# Altium schematic sheet bozza.SchDoc
size A3; Organization: Altium Limited; Address1: L3, 12a Rodborough Rd; Address2: Frenchs Forest; Address3: NSW; Address4: Australia 2086
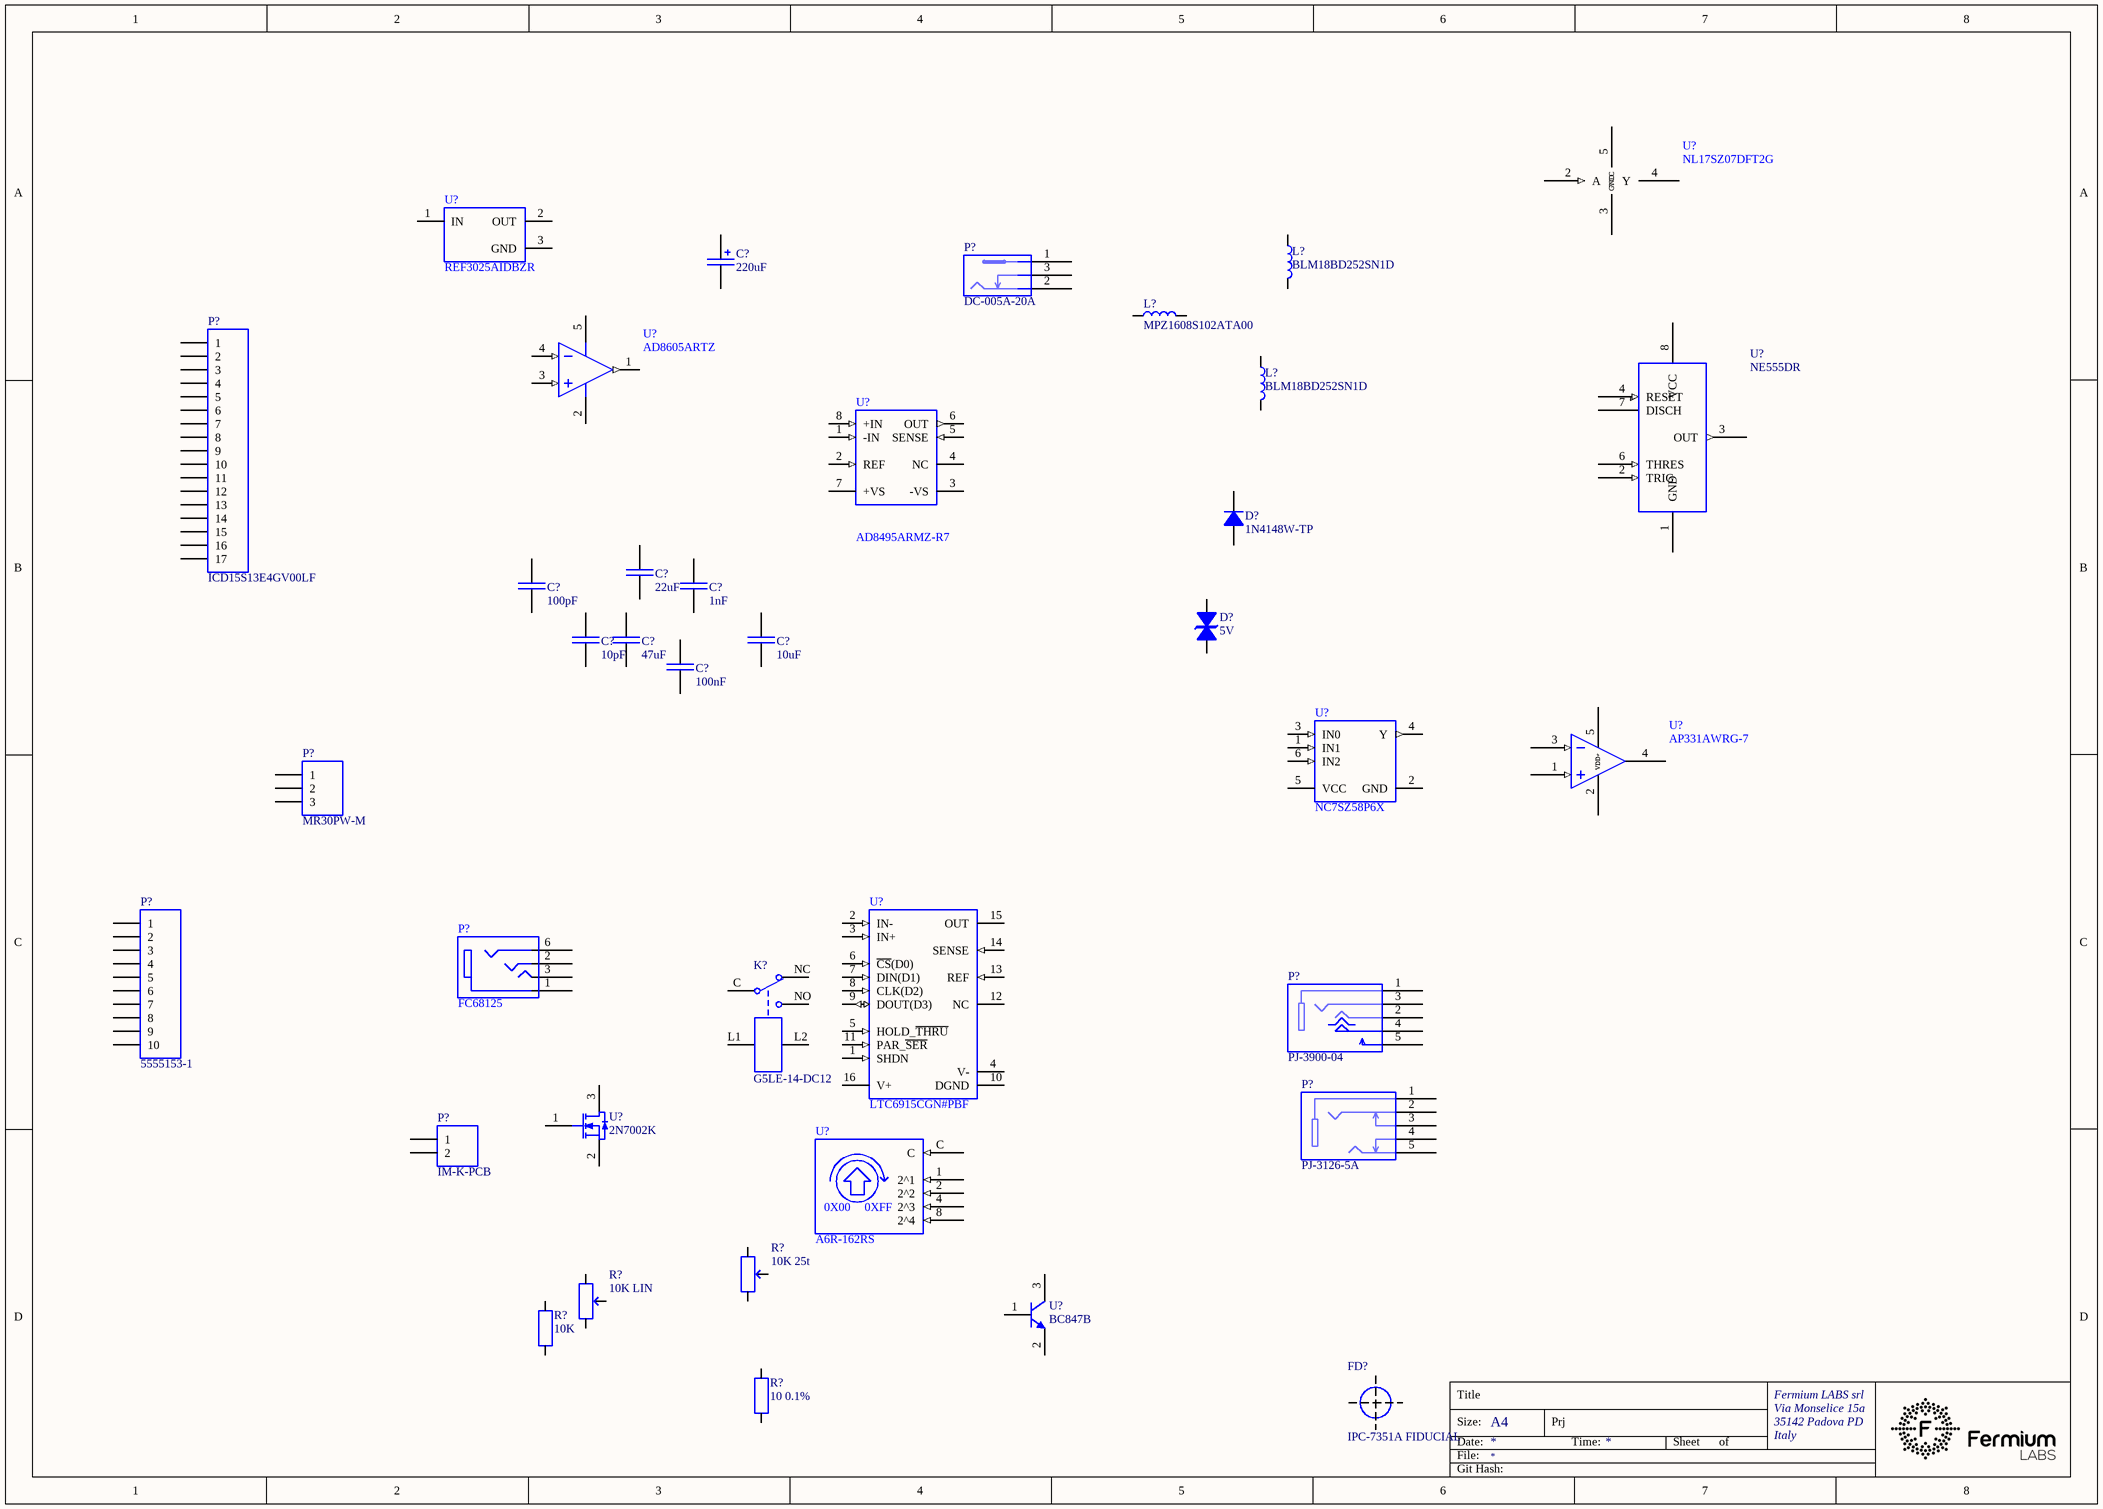
[diagram p0: bozza.SchDoc]

## Parts
(Parts that share a designator on the sheet are numbered #1, #2 ... from top to bottom, then left to right.)
C?#1  220uF  [3924B366-8672-45E9-B0BE-62DACC24E783]
C?#2  22uF  [CAP 0805_2012]
C?#3  100pF  [CAP 0603_1608]
C?#4  1nF  [CAP 0603_1608]
C?#5  10pF  [CAP 0603_1608]
C?#6  47uF  [CAP 0805_2012]
C?#7  10uF  [CAP 0805_2012]
C?#8  100nF  [CAP 0603_1608]
D?#1  1N4148W-TP  [SOD-123]
D?#2  5V  [SOD523F]
FD?  IPC-7351A FIDUCIAL  [FIDUCIAL-IPC-7351A]  (no BOM)
K?  G5LE-14-DC12  [AAE46D0F-8D2F-4914-8614-C04E242B4758]
L?#1  BLM18BD252SN1D  [FER 0603_1608]
L?#2  MPZ1608S102ATA00  [FER 0603_1608]
L?#3  BLM18BD252SN1D  [FER 0603_1608]
P?#1  DC-005A-20A  [F0972D8A-C5C0-4A84-836D-A9666EE65C2D]
P?#2  ICD15S13E4GV00LF  [66D8AC91-DC10-42D3-BF25-693004815827]
P?#3  MR30PW-M  [B3F23392-877C-4EEC-B1AF-B260E8D92153]
P?#4  5555153-1  [03FA2727-72E9-446E-856D-3DD573B1EBDD]
P?#5  FC68125  [977BFFC7-4CFC-4119-A8B4-AB88E5A1DB2B]
P?#6  PJ-3900-04  [7EF2B92C-0FC9-4C85-B662-5CEC65BFCCC4]
P?#7  IM-K-PCB  [9044FB30-693E-4780-9B0B-95C5421D70E8]
P?#8  PJ-3126-5A  [3F7AFE8B-E12E-4878-809B-9EBB3B006689]
R?#1  10K 25t  [F9540903-09ED-4909-856A-DED10E64451E]
R?#2  10K LIN  [2EF88547-EDEF-4A49-A522-C215618D4BC7]
R?#3  10K  [RES 0603_1608]
R?#4  10 0.1%  [RES 0603_1608]
U?#1  REF3025AIDBZR  [TI SOT-23-3 DBZ]
U?#2  NL17SZ07DFT2G  [9DE955BE-AB92-4157-9666-3C064124D2CC]
U?#3  AD8605ARTZ  [A3DDA0BC-073E-4B18-9613-F713A7EC1E27]
U?#4  AD8495ARMZ-R7  [ANALOG MSOP-8 RM-8]
U?#5  NE555DR  [TI SOIC-8 D]
U?#6  NC7SZ58P6X  [CF792C6F-51F3-4C59-9918-AD84EFC14FA6]
U?#7  AP331AWRG-7  [TI SOT-23-5 DBV]
U?#8  LTC6915CGN#PBF  [517EE8A2-9FD8-4174-996D-BDBF76CA3EEB]
U?#9  2N7002K  [ON SEMI SOT-23-3]
U?#10  A6R-162RS  [2599C238-5645-4A8C-8BF9-C7515FACCFA0]
U?#11  BC847B  [TI SOT-23-3 DBZ]

## Nets

Not connected (* = marked no-connect by the designer): C?#1 1 2; C?#2 1 2; C?#3 1 2; C?#4 1 2; C?#5 1 2; C?#6 1 2; C?#7 1 2; C?#8 1 2; D?#1 1(K) 2(A); D?#2 1 2; K? C L1 L2 NC NO; L?#1 1 2; L?#2 1 2; L?#3 1 2; P?#1 1 2 3; P?#2 1 2 3 4 5 6 7 8 9 10 11 12 13 14 15 16 17; P?#3 1 2 3; P?#4 1 2 3 4 5 6 7 8 9 10; P?#5 1 2 3 6; P?#6 1(GND) 2(R) 3(L) 4(AUX) 5(AUX); P?#7 1 2; P?#8 1 2 3 4 5; R?#1 1 2 3; R?#2 1 2 3; R?#3 1 2; R?#4 1 2; U?#1 1(IN) 2(OUT) 3(GND); U?#2 2(A) 3(GND) 4(Y) 5(VCC); U?#3 1(OUT) 2(-V) 3(+IN) 4(-IN) 5(+V); U?#4 1(-IN) 2(REF) 3(-VS) 4(NC) 5(SENSE) 6(OUT) 7(+VS) 8(+IN); U?#5 1(GND) 2(TRIG) 3(OUT) 4(RESET) 6(THRES) 7(DISCH) 8(VCC); U?#6 1(IN1) 2(GND) 3(IN0) 4(Y) 5(VCC) 6(IN2); U?#7 1(IN+) 2(VDD-) 3(IN-) 4(OUT) 5(VDD+); U?#8 1(SHDN) 2(IN-) 3(IN+) 4(V-) 5(HOLD_~{THRU}) 6(~{CS}(D0)) 7(DIN(D1)) 8(CLK(D2)) 9(DOUT(D3)) 10(DGND) 11(PAR_~{SER}) 12(NC) 13(REF) 14(SENSE) 15(OUT) 16(V+); U?#9 1(G) 2(S) 3(D); U?#10 1(2^1) 2(2^2) 4(2^3) 8(2^4) C; U?#11 1(B) 2(E) 3(C)

## Notes on the sheet
- Title
- Fermium LABS srl
- Size:
- Date:
- File:
- A4
- Prj
- Time:
- Sheet
- of
- Via Monselice 15a
- 35142 Padova PD
- Italy
- Git Hash:
- (in symbol bbf157ad-cd7a-4e82-97e3-d6a037590888) 0X00; 0XFF

## Library data of the parts
C?#1 = 1a28df19-6d3e-4a71-836c-f22920f8e8ab: CAP  THT ELEC 220uF 25V 20%; Manufacturer 1: Rubycon; Manufacturer Part Number 1: 25PK220MEFC-6.3*11; id: 14782; Part Number: 1a28df19-6d3e-4a71-836c-f22920f8e8ab; ComponentLink1Description: Datasheet; ComponentLink1URL: http://localhost:8080/static/files/Rubycon-220uF-25V_C109337_12019-03-10_214953.757848.pdf?Rubycon-220uF-25V_C109337 (1).pdf; Value: 220uF
C?#2 = 4e18e584-a077-4dfe-b9da-5e528e787323: CAP SMD MLCC 22uF 25V 0805 X5R; Manufacturer 1: Samsung Electro-Mechanics; Manufacturer Part Number 1: CL21A106KAYNNNE; id: 14817; Part Number: 4e18e584-a077-4dfe-b9da-5e528e787323; Manufacturer 2: Murata; Manufacturer Part Number 2: GRM21BR61E106KA73L; Value: 22uF
C?#3 = ccf679fd-1b09-4431-be81-04c3ce295510: CAP SMD MLCC 100pF 100V 0603 C0G/NP0; Manufacturer 1: Yageo; Manufacturer Part Number 1: CC0603JRNPO0BN101; id: 14804; Part Number: ccf679fd-1b09-4431-be81-04c3ce295510; Value: 100pF
C?#4 = 0eca2548-3630-4fea-a3d5-94248c1cae74: CAP SMD MLCC 1nF 50V 0603 X7R; Manufacturer 1: Samsung Electro-Mechanics; Manufacturer Part Number 1: CL10B102KB8NNNC; id: 14785; Part Number: 0eca2548-3630-4fea-a3d5-94248c1cae74; ComponentLink1Description: Datasheet; ComponentLink1URL: http://localhost:8080/static/files/Samsung-Electro-Mechanics-CL10B102KB8NNNC_C1588_12019-03-10_215732.131818.pdf?Samsung-Electro-Mechanics-CL10B102KB8NNNC_C1588 (1).pdf; Value: 1nF
C?#5 = b659b677-71ac-4e84-9ac8-47a475f18d31: CAP SMD MLCC 10pF 50V 0603 C0G/NP0; Manufacturer 1: Yageo; Manufacturer Part Number 1: CC0603GRNPO9BN100; id: 14805; Part Number: b659b677-71ac-4e84-9ac8-47a475f18d31; Value: 10pF
C?#6 = 7e40707e-5198-472b-97ae-d9f3cd497999: CAP SMD MLCC 47uF 6.3V 0805 X5R; Manufacturer 1: Murata; Manufacturer Part Number 1: GRM21BR60J476ME15L; id: 14816; Part Number: 7e40707e-5198-472b-97ae-d9f3cd497999; Manufacturer 2: Taiyo Yuden; Manufacturer Part Number 2: JMK212BJ476MG-T; Value: 47uF
C?#7 = 1ffbe5a9-0884-4740-bdad-20a6a98400e6: CAP SMD MLCC 10uF 25V 0805 X5R; Manufacturer 1: Samsung Electro-Mechanics; Manufacturer Part Number 1: CL21A106KAYNNNE; id: 14779; Part Number: 1ffbe5a9-0884-4740-bdad-20a6a98400e6; ComponentLink1Description: Datasheet; ComponentLink1URL: http://localhost:8080/static/files/Samsung-Electro-Mechanics-CL21A106KAYNNNE_C158502019-03-10_213827.610739.pdf?Samsung-Electro-Mechanics-CL21A106KAYNNNE_C15850.pdf; Manufacturer 2: Murata; Manufacturer Part Number 2: GRM21BR61E106KA73L; Value: 10uF
C?#8 = 02841f84-ac15-41b5-9e17-915f8f067828: CAP SMD MLCC 100nF 25V 0603 X7R; Manufacturer 1: Samsung Electro-Mechanics; Manufacturer Part Number 1: CL10B104KA8NNNC; id: 14784; Part Number: 02841f84-ac15-41b5-9e17-915f8f067828; ComponentLink1Description: Datasheet; ComponentLink1URL: http://localhost:8080/static/files/Samsung-Electro-Mechanics-CL10B104KA8NNNC_C15902019-03-10_215548.826887.pdf?Samsung-Electro-Mechanics-CL10B104KA8NNNC_C1590.pdf; Value: 100nF
D?#1 = 5e920700-75df-48e3-84dd-8f9f777caed8: DIODE SMD 100V 150mA 1.5Vf SOD-123 4148; Manufacturer 1: MCC; id: 14795; Part Number: 5e920700-75df-48e3-84dd-8f9f777caed8; ComponentLink1Description: Datasheet; ComponentLink1URL: http://localhost:8080/static/files/Micro-Commercial-Components-MCC-1N4148W-TP_C779782019-04-06_215019.428643.pdf?Micro-Commercial-Components-MCC-1N4148W-TP_C77978.pdf; Manufacturer Part Number 1: 1N4148W-TP
D?#2 = daa58212-38e2-4326-a156-8e48058c46f1: DIODE SMD TVS 5V BIDIRECTIONAL SOD-523; Manufacturer 1: Born Semiconductor; Manufacturer Part Number 1: PESD5V0S1BBN; id: 14837; Part Number: daa58212-38e2-4326-a156-8e48058c46f1; ComponentLink1Description: Datasheet; ComponentLink1URL: http://localhost:8080/static/files/Nexperia-PESD5V0S1BB-115_C976402019-08-16_201905.624024.pdf?Nexperia-PESD5V0S1BB-115_C97640.pdf; ComponentLink2Description: Datasheet; ComponentLink2URL: http://localhost:8080/static/files/1901051701_Bourne-Semicon-Shenzhen-PESD5V0S1BBN_C3142642019-08-16_201911.992552.pdf?1901051701_Bourne-Semicon-Shenzhen-PESD5V0S1BBN_C314264.pdf; Manufacturer 2: Nexperia; Manufacturer Part Number 2: PESD5V0S1BB,115; Value: 5V
FD? = 19da4612-eb95-43bb-9984-553a52b2a224: GRAPHICS FIDUCIAL IPC-7351A; id: 14800; Part Number: 19da4612-eb95-43bb-9984-553a52b2a224
K? = daf6f3cd-58c4-4886-bcb7-b7b47a76ae08: RELAY SPDT 10A 250VAC 12VDC SUBMINIATURE; Manufacturer 1: Omron; id: 14836; Part Number: daf6f3cd-58c4-4886-bcb7-b7b47a76ae08; ComponentLink1Description: Datasheet; ComponentLink1URL: http://localhost:8080/static/files/Omron-Electronics-G5LE-14-DC12_C116964_12019-08-16_200915.378527.pdf?Omron-Electronics-G5LE-14-DC12_C116964 (1).pdf; Manufacturer Part Number 1: G5LE-14-DC12
L?#1 L?#3 = c9e30ae8-9d5b-4135-a079-b1147da846d8: FER SMD CHIP 0603 150mA 2.5K@100MHz 500mOhm; Manufacturer 1: Murata; id: 14786; Part Number: c9e30ae8-9d5b-4135-a079-b1147da846d8; ComponentLink1Description: Datasheet; ComponentLink1URL: http://localhost:8080/static/files/Murata-Electronics-BLM18AG102SN1D_C858242019-03-10_220021.186607.pdf?Murata-Electronics-BLM18AG102SN1D_C85824.pdf; Manufacturer Part Number 1: BLM18BD252SN1D
L?#2 = a4b2e015-bf25-47b8-954c-a5b040744a3a: FER SMD CHIP 0603 800mA 1K@100MHz 300mOhm; Manufacturer 1: TDK; id: 14850; Part Number: a4b2e015-bf25-47b8-954c-a5b040744a3a; ComponentLink1Description: Datasheet; ComponentLink1URL: http://localhost:8080/static/files/TDK-MPZ1608S102ATA00_C768142019-08-18_021255.210641.pdf?TDK-MPZ1608S102ATA00_C76814.pdf; Manufacturer Part Number 1: MPZ1608S102ATA00
P?#1 = b53db51a-1725-412b-9039-fa7a45c7c438: CONN THT DC JACK 0.5A 30VDC 5Kcycles; Manufacturer 1: HRO Electronics; id: 14780; Part Number: b53db51a-1725-412b-9039-fa7a45c7c438; ComponentLink1Description: Datasheet; ComponentLink1URL: http://localhost:8080/static/files/Korean-Hroparts-Elec-DC-005A-20A_C191049_22019-03-10_214231.486078.pdf?Korean-Hroparts-Elec-DC-005A-20A_C191049 (2).pdf; Manufacturer Part Number 1: DC-005A-20A
P?#2 = af155709-b835-40ac-b9b5-4a44b0fd2777: CONN D-SUB HD 15POLES BLACK THT; Manufacturer 1: FCI; id: 14838; Part Number: af155709-b835-40ac-b9b5-4a44b0fd2777; ComponentLink1Description: Mechanical Drawing; ComponentLink1URL: http://localhost:8080/static/files/c-cd-00112019-08-16_203054.958624.pdf?c-cd-0011.pdf; ComponentLink2Description: Datasheet; ComponentLink2URL: http://localhost:8080/static/files/io_dsub_highdensity2019-08-16_203112.582695.pdf?io_dsub_highdensity.pdf; Manufacturer Part Number 1: ICD15S13E4GV00LF
P?#3 = 8565bfd1-7a71-455a-a363-4ce9dda60de6: CONN DC 3 POLE 15A PCB MALE; Manufacturer 1: Changzhou Amass Elec; id: 14833; Part Number: 8565bfd1-7a71-455a-a363-4ce9dda60de6; ComponentLink1Description: Datasheet; ComponentLink1URL: http://localhost:8080/static/files/MR30PW_SPEC2019-08-16_190138.191607.pdf?MR30PW SPEC.pdf; ComponentLink2Description: 3D Model; ComponentLink2URL: http://localhost:8080/static/files/B3F23392-877C-4EEC-B1AF-B260E8D921532019-08-16_190154.620416.step?B3F23392-877C-4EEC-B1AF-B260E8D92153.step; Manufacturer Part Number 1: MR30PW-M
P?#4 = f401b84a-9695-45b1-951e-00bef0039069: CONN RJ45 SHIELDED; Manufacturer 1: TE Connectivity; id: 14843; Part Number: f401b84a-9695-45b1-951e-00bef0039069; ComponentLink1Description: Product Page; ComponentLink1URL: https://www.te.com/usa-en/product-5555153-1.html?te_campaign=oct_glo_manufacturer&elqCampaignId=26136&te_bu=Cor&te_type=other; ComponentLink2Description: Datasheet; ComponentLink2URL: http://localhost:8080/static/files/TE-Connectivity-5555153-1_C1250722019-08-17_152708.984028.pdf?TE-Connectivity-5555153-1_C125072.pdf; ComponentLink3Description: 3D Model; ComponentLink3URL: http://localhost:8080/static/files/ENG_CVM_CVM_5555153-1_C.3d_stp2019-08-17_152716.824354.zip?ENG_CVM_CVM_5555153-1_C.3d_stp.zip; Manufacturer Part Number 1: 5555153-1
P?#5 = 3e3c57e9-f1b8-4c12-8bb1-97da9eb9c220: CONN JACK 3.5MM 4POLE THT; Manufacturer 1: Cliff; id: 14844; Part Number: 3e3c57e9-f1b8-4c12-8bb1-97da9eb9c220; ComponentLink1Description: Datasheet; ComponentLink1URL: http://localhost:8080/static/files/Cliff-FC68125-datasheet2019-08-17_161810.238588.pdf?Cliff-FC68125-datasheet.pdf; Manufacturer Part Number 1: FC68125
P?#6 = 80507a24-5d7c-4cf5-953e-f54832d54564: CONN THT 3.5mm AUDIO STEREO AUX SWITCH; Manufacturer 1: HRO Electronics; id: 14793; Part Number: 80507a24-5d7c-4cf5-953e-f54832d54564; ComponentLink1Description: Datasheet; ComponentLink1URL: http://localhost:8080/static/files/Korean-Hroparts-Elec-PJ-3900-04_C1518392019-04-10_231144.687617.pdf?Korean-Hroparts-Elec-PJ-3900-04_C151839.pdf; Manufacturer Part Number 1: PJ-3900-04
P?#7 = 44088476-53fa-4578-a611-1fd63affe7b4: CONN THERMOCOUPLE K-TYPE THT; Manufacturer 1: Labfacility; id: 14845; Part Number: 44088476-53fa-4578-a611-1fd63affe7b4; ComponentLink1Description: Datasheet; ComponentLink1URL: http://localhost:8080/static/files/28420972019-08-17_162400.037613.pdf?2842097.pdf; Manufacturer Part Number 1: IM-K-PCB
P?#8 = aa2491ce-9f07-4b8f-8323-7e7c4579e059: CONN THT 3.5mm AUDIO STEREO DOUBLE SWITCH; Manufacturer 1: HRO Electronics; id: 14781; Part Number: aa2491ce-9f07-4b8f-8323-7e7c4579e059; ComponentLink1Description: Datasheet; ComponentLink1URL: http://localhost:8080/static/files/Korean-Hroparts-Elec-PJ-3126-5A_C145816_22019-03-10_214809.050063.pdf?Korean-Hroparts-Elec-PJ-3126-5A_C145816 (2).pdf; Manufacturer Part Number 1: PJ-3126-5A
R?#1 = 613f65ed-4d8d-44d0-9fe5-67eff78392c9: POT TRIMMER LINEAR 10K 25TURNS VERT THT; Manufacturer 1: Bourns; Manufacturer Part Number 1: 3296W-1-103LF; id: 14847; Part Number: 613f65ed-4d8d-44d0-9fe5-67eff78392c9; ComponentLink1Description: 3D Model; ComponentLink1URL: http://localhost:8080/static/files/3296W_v12019-08-17_171307.552870.step?3296W v1.step; ComponentLink2Description: Datasheet; ComponentLink2URL: http://localhost:8080/static/files/BOURNS-3296W-1-103LF_C348462019-08-17_171320.734450.pdf?BOURNS-3296W-1-103LF_C34846.pdf; Value: 10K 25t
R?#2 = 3df905ea-1e80-4add-859d-a36edd7f106c: POT 10K 20% SHAFT 6mmx7.4mm LIN; Manufacturer 1: ALPS; Manufacturer Part Number 1: RK09K1130A6S; id: 14828; Part Number: 3df905ea-1e80-4add-859d-a36edd7f106c; ComponentLink1Description: 3D Model; ComponentLink1URL: http://localhost:8080/static/files/RK09K1130A6S2019-08-17_031625.830758.zip?RK09K1130A6S.zip; ComponentLink2Description: Datasheet; ComponentLink2URL: http://localhost:8080/static/files/ALPS-Electric-RK09K1130A6S_C2097702019-08-17_031651.036431.pdf?ALPS-Electric-RK09K1130A6S_C209770.pdf; Value: 10K LIN
R?#3 = 93242766-ba1d-462d-b58f-ce1dfc4129c8: RES SMD 10K OHM 1% 1/10W 0603; Manufacturer 1: Yageo; Manufacturer Part Number 1: RC0603FR-0710KL; id: 12101; Part Number: 93242766-ba1d-462d-b58f-ce1dfc4129c8; Value: 10K
R?#4 = f0166db1-b7e4-4c18-9511-2907615c1c51: RES SMD 10 OHM 0.1% 1/16W 25ppm  0603; Manufacturer 1: Uniroyal; Manufacturer Part Number 1: TC0325B100JT5E; id: 14842; Part Number: f0166db1-b7e4-4c18-9511-2907615c1c51; Manufacturer 2: Viking Tech; Manufacturer Part Number 2: AR03BTCX0100; Value: 10 0.1%
U?#1 = 0de0df07-6dfd-42d8-9fe7-171c27772811: IC VOLTAGE REF SERIES 2.5V 75ppm 0.2% SOT-23; Manufacturer 1: Texas Instruments; id: 14831; Part Number: 0de0df07-6dfd-42d8-9fe7-171c27772811; ComponentLink1Description: Datasheet; ComponentLink1URL: http://localhost:8080/static/files/Texas-Instruments-TI-REF3025AIDBZR_C113342019-08-16_180357.548624.pdf?Texas-Instruments-TI-REF3025AIDBZR_C11334.pdf; Manufacturer Part Number 1: REF3025AIDBZR
U?#2 = a3d656f3-fbd6-4576-b355-9fd6caec7ecf: IC SMD BUFFER NON-INVERTING OPEN-DRAIN SOT-353; Manufacturer 1: ON Semiconductor; id: 14811; Part Number: a3d656f3-fbd6-4576-b355-9fd6caec7ecf; ComponentLink1Description: Datasheet; ComponentLink1URL: http://localhost:8080/static/files/ON-Semicon-ON-NL17SZ07DFT2G_C1132552019-04-29_221711.207916.pdf?ON-Semicon-ON-NL17SZ07DFT2G_C113255.pdf; Manufacturer Part Number 1: NL17SZ07DFT2G
U?#3 = 5610e9ea-bca8-49b2-8e5f-11409231f6a4: IC OPAMP 65uV 1pA RRIO 5V 80mA SOT-23-5; Manufacturer 1: Analog Devices; id: 14830; Part Number: 5610e9ea-bca8-49b2-8e5f-11409231f6a4; ComponentLink1Description: Datasheet; ComponentLink1URL: http://localhost:8080/static/files/Analog_Devices-AD8605ARTZ-REEL7-datasheet2019-08-16_175825.352099.pdf?Analog_Devices-AD8605ARTZ-REEL7-datasheet.pdf; Manufacturer Part Number 1: AD8605ARTZ
U?#4 = 8cc7f909-42c7-4251-909a-43740f41a1ca: IC THERMOCOUPLE AMPLIFIER MSOP-8; Manufacturer 1: Analog Devices; id: 14832; Part Number: 8cc7f909-42c7-4251-909a-43740f41a1ca; ComponentLink1Description: Datasheet; ComponentLink1URL: http://localhost:8080/static/files/Analog-Devices-ADI-AD8495ARMZ-R7_C596582019-08-16_182304.166986.pdf?Analog-Devices-ADI-AD8495ARMZ-R7_C59658.pdf; Manufacturer Part Number 1: AD8495ARMZ-R7
U?#5 = d16ab88a-2543-469a-8940-7b800b633548: IC SMD TIMER NE555 SOIC-8; Manufacturer 1: Texas Instruments; id: 14787; Part Number: d16ab88a-2543-469a-8940-7b800b633548; ComponentLink1Description: Datasheet; ComponentLink1URL: http://localhost:8080/static/files/Texas-Instruments-TI-NE555DR_C7593_22019-03-10_221020.033506.pdf?Texas-Instruments-TI-NE555DR_C7593 (2).pdf; Manufacturer Part Number 1: NE555DR
U?#6 = 22da43c7-1950-42f4-bc93-10d9cca79b4d: IC LOGIC PORT CONFIGURABLE AND, OR, NAND, NOR, XOR, BUFFER, NOT 8ns  74XX58 SC-70; Manufacturer 1: ON Semiconductor; id: 14841; Part Number: 22da43c7-1950-42f4-bc93-10d9cca79b4d; ComponentLink1Description: Datasheet; ComponentLink1URL: http://localhost:8080/static/files/1812220431_ON-Semicon-ON-NC7SZ58P6X_C2328042019-08-17_005741.293796.pdf?1812220431_ON-Semicon-ON-NC7SZ58P6X_C232804.pdf; ComponentLink2Description: Datasheet; ComponentLink2URL: http://localhost:8080/static/files/Texas-Instruments-TI-SN74LVC1G58DCKR_C78422019-08-17_005749.189474.pdf?Texas-Instruments-TI-SN74LVC1G58DCKR_C7842.pdf; Manufacturer 2: Texas Instruments; Manufacturer Part Number 1: NC7SZ58P6X; Manufacturer Part Number 2: SN74LVC1G58DCKR
U?#7 = cc0aaf1e-2921-4678-a6db-9bfd1410fe7e: IC COMPARATOR 4mV 150nA G-SENSE LMV331 SOT-23-5; Manufacturer 1: Diodes Inc.; id: 14840; Part Number: cc0aaf1e-2921-4678-a6db-9bfd1410fe7e; ComponentLink1Description: Datasheet; ComponentLink1URL: http://localhost:8080/static/files/Diodes-Incorporated-AP331AWRG-7_C1515612019-08-17_003444.032295.pdf?Diodes-Incorporated-AP331AWRG-7_C151561.pdf; ComponentLink2Description: Datasheet; ComponentLink2URL: http://localhost:8080/static/files/3PEAK-LMV331TP-TR_C1080952019-08-17_003453.117876.pdf?3PEAK-LMV331TP-TR_C108095.pdf; ComponentLink3Description: Datasheet; ComponentLink3URL: http://localhost:8080/static/files/Texas-Instruments-TI-TL331IDBVR_C809422019-08-17_003503.609716.pdf?Texas-Instruments-TI-TL331IDBVR_C80942.pdf; Manufacturer 2: 3Peak; Manufacturer 3: Texas Instruments; Manufacturer Part Number 1: AP331AWRG-7; Manufacturer Part Number 2: LMV331TP-TR; Manufacturer Part Number 3: TL331IDBVR
U?#8 = 59fe82cd-fd18-4813-9f52-e2e78a460aff: IC PGA G0-4094 SPI-PARALLEL 5V RRIO SSOP-16; Manufacturer 1: Analog Devices; id: 14835; Part Number: 59fe82cd-fd18-4813-9f52-e2e78a460aff; ComponentLink1Description: Datasheet; ComponentLink1URL: http://localhost:8080/static/files/Linear_Technology-LTC6915CDEPBF-datasheet2019-08-16_194420.284095.pdf?Linear_Technology-LTC6915CDE#PBF-datasheet.pdf; Manufacturer Part Number 1: LTC6915CGN#PBF
U?#9 = 3a318f0a-3b94-47d9-91d5-8fc0a2f410e8: MOSFET N-CHANNEL LOGIC LEVEL 300mA 3ohm 60V ESD-PROT 2N7002K SOT-23; Manufacturer 1: ON Semiconductor; Manufacturer Part Number 1: 2N7002KT1G; id: 14846; Part Number: 3a318f0a-3b94-47d9-91d5-8fc0a2f410e8; ComponentLink1Description: Datasheet; ComponentLink1URL: http://localhost:8080/static/files/ON-Semicon-ON-2N7002KT1G_C1165842019-08-17_164859.682835.pdf?ON-Semicon-ON-2N7002KT1G_C116584.pdf; ComponentLink2Description: Datasheet; ComponentLink2URL: http://localhost:8080/static/files/Vishay-Intertech-2N7002K-T1-GE3_C814452019-08-17_164907.199439.pdf?Vishay-Intertech-2N7002K-T1-GE3_C81445.pdf; ComponentLink3Description: Datasheet; ComponentLink3URL: http://localhost:8080/static/files/DATA; Manufacturer 2: Vishay; Manufacturer 3: Diodes Inc.; Manufacturer Part Number 2: 2N7002K-T1-GE3; Manufacturer Part Number 3: 2N7002K-7
U?#10 = bbf157ad-cd7a-4e82-97e3-d6a037590888: SWITCH ROTARY HEX/BCD 16 POSITIONS; Manufacturer 1: Omron; id: 14834; Part Number: bbf157ad-cd7a-4e82-97e3-d6a037590888; ComponentLink1Description: Datasheet; ComponentLink1URL: http://localhost:8080/static/files/A6R-A6RV2019-08-16_190638.241287.PDF?A6R-A6RV.PDF; ComponentLink2Description: 3D Model; ComponentLink2URL: http://localhost:8080/static/files/2599C238-5645-4A8C-8BF9-C7515FACCFA02019-08-16_192704.487115.step?2599C238-5645-4A8C-8BF9-C7515FACCFA0.step; Manufacturer Part Number 1: A6R-162RS
U?#11 = 518be146-f87c-4403-9352-4982c61a9251: TRANS NPN BC847 100mA 40V 220mW SOT-23-3; Manufacturer 1: Nexperia; id: 14791; Part Number: 518be146-f87c-4403-9352-4982c61a9251; ComponentLink1Description: Datasheet; ComponentLink1URL: http://localhost:8080/static/files/Nexperia-BC847B-215_C57668_32019-03-11_205443.293175.pdf?Nexperia-BC847B-215_C57668 (3).pdf; Manufacturer Part Number 1: BC847B